# EAGLE design 2d_input (EAGLE 9.2.2)
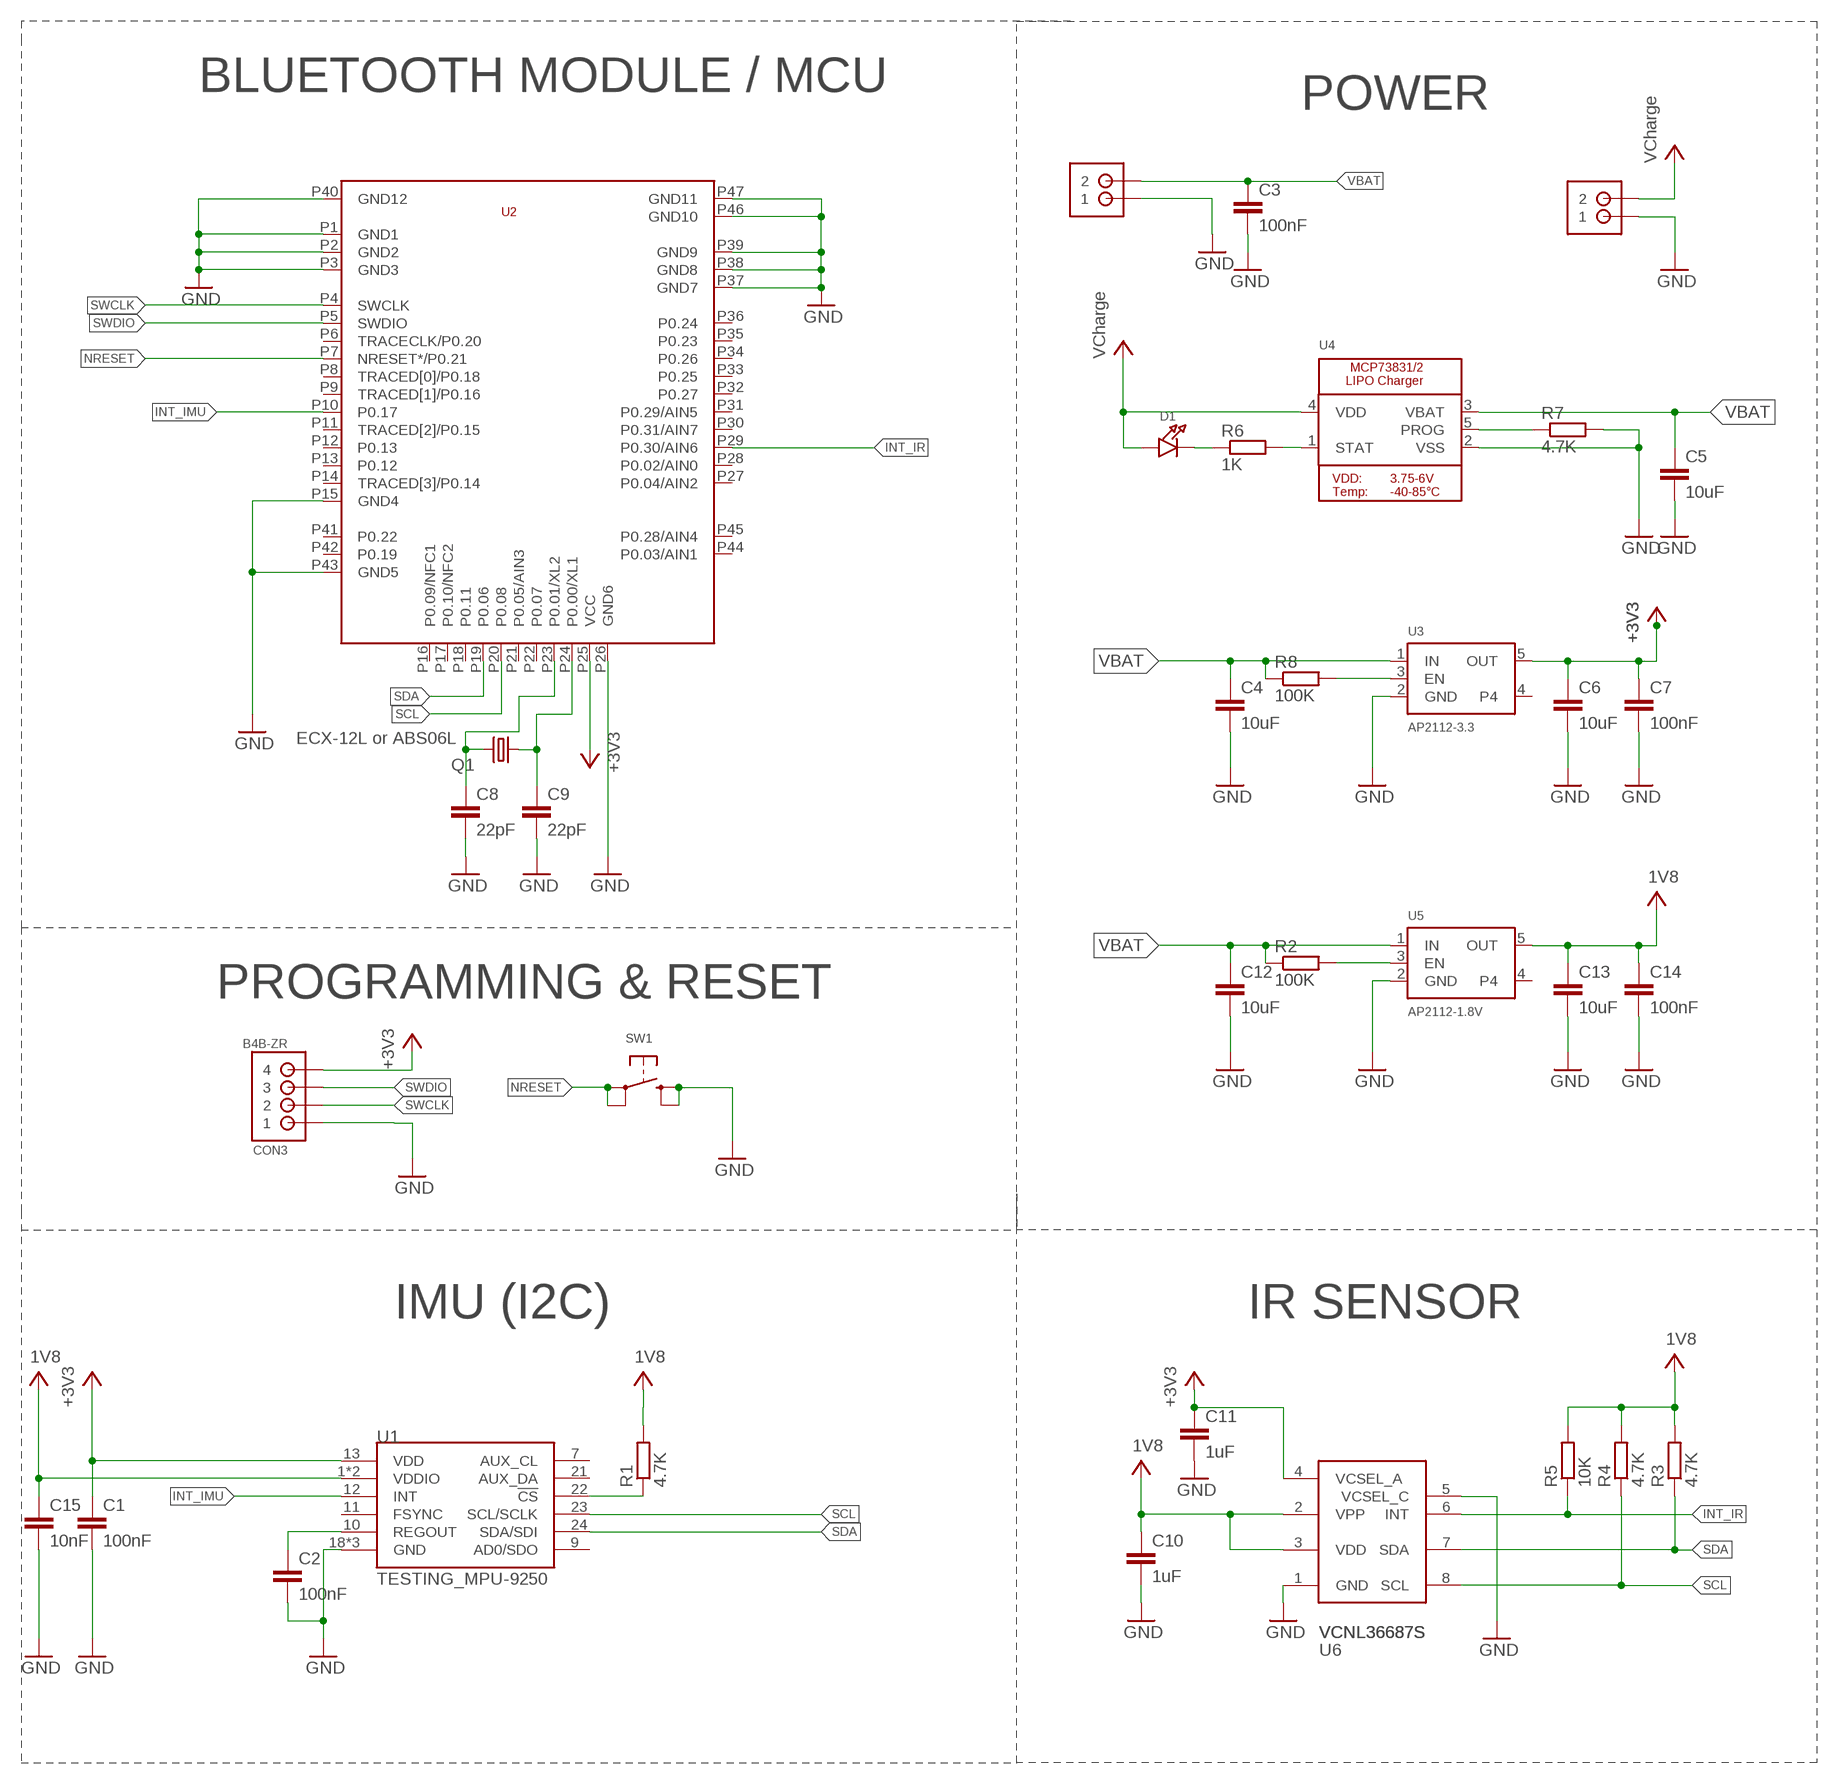
[diagram p0: schematic, sheet 1]

## Parts
C1  100nF  C-EUC0402K  [C0402K]
C2  100nF  C-EUC0402K  [C0402K]
C3  100nF  C-EUC0402K  [C0402K]
C4  10uF  C-EUC0402K  [C0402K]
C5  10uF  C-EUC0402K  [C0402K]
C6  10uF  C-EUC0402K  [C0402K]
C7  100nF  C-EUC0402K  [C0402K]
C8  22pF  C-EUC0402K  [C0402K]
C9  22pF  C-EUC0402K  [C0402K]
C10  1uF  C-EUC0402K  [C0402K]
C11  1uF  C-EUC0402K  [C0402K]
C12  10uF  C-EUC0402K  [C0402K]
C13  10uF  C-EUC0402K  [C0402K]
C14  100nF  C-EUC0402K  [C0402K]
C15  10nF  C-EUC0402K  [C0402K]
CON1  B2B-ZR  [B2B-ZR]
CON2  B2B-ZR  [B2B-ZR]
CON3  B4B-ZR  [B4B-ZR]
D1  MICROBUILDER_LED0603_NOOUTLINE  [MICROBUILDER_CHIPLED_0603_NOOUTLINE]
Q1  ECX-12L or ABS06L  KX-327-RT  [2.0X1.2]
R1  4.7K  R-EU_R0402  [R0402]
R2  100K  R-EU_R0402  [R0402]
R3  4.7K  R-EU_R0402  [R0402]
R4  4.7K  R-EU_R0402  [R0402]
R5  10K  R-EU_R0402  [R0402]
R6  1K  R-EU_R0402  [R0402]
R7  4.7K  R-EU_R0402  [R0402]
R8  100K  R-EU_R0402  [R0402]
SW1  MICROBUILDER_SWITCH_TACT_SMT4.6X2.8  [MICROBUILDER_BTN_KMR2_4.6X2.8]
U1  TESTING_MPU-9250  [TESTING_QFN24_PAD]
U2  BMD-350  [BMD-350]
U3  AP2112-3.3  MICROBUILDER_VREG_SOT23-5  [MICROBUILDER_SOT23-5]
U4  MICROBUILDER_MCP73831/2  [MICROBUILDER_SOT23-5]
U5  AP2112-1.8V  MICROBUILDER_VREG_SOT23-5  [MICROBUILDER_SOT23-5]
U6  VCNL36687S  [VCNL36687S]

## Nets
+3V3: C1.1 C6.1 C7.1 C11.1 CON3.4 U1.13(VDD) U2.P25(VCC) U3.5(OUT) U6.4(VCSEL_A)
GND: C1.2 C2.2 C3.2 C4.2 C5.2 C6.2 C7.2 C8.2 C9.2 C10.2 C11.2 C12.2 C13.2 C14.2 C15.2 CON1.1 CON2.1 CON3.1 R7.2 SW1.B'(S1) SW1.B(S) U1.18(GND) U1.20(GND) U1.CENTER(GND) U2.P1(GND1) U2.P2(GND2) U2.P3(GND3) U2.P15(GND4) U2.P26(GND6) U2.P37(GND7) U2.P38(GND8) U2.P39(GND9) U2.P40(GND12) U2.P43(GND5) U2.P46(GND10) U2.P47(GND11) U3.2(GND) U4.2(VSS) U5.2(GND) U6.1(GND) U6.5(VCSEL_C)
INT_IMU: U1.12(INT) U2.P10(P0.17)
INT_IR: R5.1 U2.P29(P0.30/AIN6) U6.6(INT)
N$1: C2.1 U1.10(REGOUT)
N$2: R7.1 U4.5(PROG)
N$3: C9.1 Q1.1 U2.P24(P0.00/XL1)
N$4: R1.1 U1.22(!CS)
N$5: R6.2 U4.1(STAT)
N$6: D1.C R6.1
N$8: R8.2 U3.3(EN)
N$9: R2.2 U5.3(EN)
N$10: C8.1 Q1.2 U2.P23(P0.01/XL2)
NRESET: SW1.A'(P1) SW1.A(P) U2.P7(NRESET*/P0.21)
SCL: R4.1 U1.23(SCL/SCLK) U2.P20(P0.08) U6.8(SCL)
SDA: R3.1 U1.24(SDA/SDI) U2.P19(P0.06) U6.7(SDA)
SWCLK: CON3.2 U2.P4(SWCLK)
SWDIO: CON3.3 U2.P5(SWDIO)
V+: C10.1 C13.1 C14.1 C15.1 R1.2 R3.2 R4.2 R5.2 U1.1(VDDIO) U1.8(VDDIO) U5.5(OUT) U6.2(VPP) U6.3(VDD) ; supply symbol labelled 1V8
VBAT: C3.1 C4.1 C5.1 C12.1 CON1.2 R2.1 R8.1 U3.1(IN) U4.3(VBAT) U5.1(IN)
VCC: CON2.2 D1.A U4.4(VDD) ; supply symbol labelled VCharge
Unconnected: U1.7(AUX_CL) U1.9(AD0/SDO) U1.11(FSYNC) U1.21(AUX_DA) U2.P6(TRACECLK/P0.20) U2.P8(TRACED[0]/P0.18) U2.P9(TRACED[1]/P0.16) U2.P11(TRACED[2]/P0.15) U2.P12(P0.13) U2.P13(P0.12) U2.P14(TRACED[3]/P0.14) U2.P16(P0.09/NFC1) U2.P17(P0.10/NFC2) U2.P18(P0.11) U2.P21(P0.05/AIN3) U2.P22(P0.07) U2.P27(P0.04/AIN2) U2.P28(P0.02/AIN0) U2.P30(P0.31/AIN7) U2.P31(P0.29/AIN5) U2.P32(P0.27) U2.P33(P0.25) U2.P34(P0.26) U2.P35(P0.23) U2.P36(P0.24) U2.P41(P0.22) U2.P42(P0.19) U2.P44(P0.03/AIN1) U2.P45(P0.28/AIN4) U3.4 U5.4

## Notes on the sheet
- BLUETOOTH MODULE / MCU
- POWER
- PROGRAMMING & RESET
- IMU (I2C) | IR SENSOR
- VCNL36687S | VCNL36687S | VCNL36687S
- U6

## Library data of the parts
C1-C15 = rcl:C-EU: CAPACITOR, European symbol; SPICEPREFIX: C
CON1 CON2 = con-jst-zh:B2B-ZR: JST-ZH Connector 2 pol, 1.5mm pitch Package: B2B-ZR Source: http://www.jst-mfg.com/product/pdf/eng/eZH.pdf
CON3 = con-jst-zh:B4B-ZR: JST-ZH Connector 4 pol, 1.5mm pitch Package: B4B-ZR Source: http://www.jst-mfg.com/product/pdf/eng/eZH.pdf
D1 = Minniemouse_v2:MICROBUILDER_LED: LED 0603 - 0603 Surface Mount Package 2mA: Green LED - Low Power (3.9mcd, 2ma, 1.7Vf) - Digikey: 475-2709-2-ND Orange LED - Low Power (9.8mcd, 2ma, 1.8Vf) - Digikey: 475-1194-2-ND Red LED - Low Power (5mcd, 2ma, 1.8Vf) - Digikey: 475-1195-2-ND Yellow LED - Low Power (7mcd, 2ma, 1.8Vf) - Digikey: 475-1196-2-ND 5mA: Blue LED - Low Power (17mcd, 5ma, 2.9Vf) - Digikey: LNJ937W8CRACT-ND 0805 - 0805 Surface Mount Package 2mA: Red LED (8.8mcd, 2mA, 1.8Vf, Clear) - Low Power [Digikey: 475-2510-1-ND] Green LED (5mcd, 2mA, 1.8Vf, Clear) - Low Power [Digikey: 475-2730-1-ND] Yellow LED (11.3mcd, 2mA, 1.8Vf, Clear) - Low Power [Digikey: 475-2555-1-ND] 20mA: Red LED (104mcd, 20mA, Diffused) - LS R976 [Digikey: 475-1278-6-ND] Red LED (12mcd, 20mA, 2.0Vf, Clear) - APT2012EC [Digikey: 754-1128-1-ND] Green LED (15mcd, 20mA, 2.2Vf, Clear) - APT2012GC [Digikey: 754-1131-1-ND] Orange LED (160mcd, 20mA, 2.1Vf, Clear) - APT2012SECK [Digikey: 754-1130-1-ND] 1206 - 1206 Surface Mount Package Green LED (26mcd, 20mA, Diffused) - LG N971 [Digikey: 475-1407-6-ND] Red LED (15mcd, 20mA, Diffused) - LH N974 [Digikey: 475-1416-6-ND] Cree - Cree High-Power Surface Mount LEDs XPEBWT-L1-0000-00D50 - White 111lm 350mA 2.9Vf 6200K 110° XTEAWT-00-0000-00000LEE3 - White 114lm 350mA 2.85Vf 5000K 115° Everlight - Everlight 45-21 Series Surface Mount LEDs 45-21/QK2C-B2832AC2CB2/2T - Warm White 2000mcd 20mA 3.25Vf 3050K 120° 45-21/LK2C-B38452C4CB2/2T - Nuetral White 2000mcd 20mA 3.25Vf 4150K 120° 45-21/LK2C-B50634C6CB2/2T - Cold White 2200mcd 20mA 3.25Vf 5650K 120° PLCC2 Reverse Mount LS T77K-J1L2-1-0-2-R18-Z - Red 11.25mcd 2mA 1.8Vf 630nm 120° LO T77K-L1M2-24-Z - Orange 19.6mcd 2mA 1.8Vf 606nm 120° LY T77K-K2M1-26-Z - Yellow 15.7mcd 2mA 1.8Vf 587nm 120°
Q1 = crystal-geyer_V1_0:KX-327: Tuning Fork Crystals (kHz) SMD: KX327 - Serie Model Size l/w/h [mm] Frequency Range Frequency Stability Temp. Range [°C] Load Capacitance AECQ 200 availabel Datasheet KX-327VT KX-327FT KX-327RT KX-327NHT KX-327NHF KX-327L KX-327S 1.25/1.05/0.5 1.6/1.0/0.5 2.0/1.2/0.6 3.2/1.5/0.8 3.2/1.5/0.8 7.0/1.5/1.4 8.2/3.8/2.5 32,768 kHz 32,768 kHz 32,768 kHz 32,768 kHz 32,768 kHz 32,768 kHz 32,768 kHz ±10 … ±20ppm ±10 … ±20ppm ±10 … ±20ppm ±10 … ±20ppm ±10 … ±20ppm ±10 … ±20ppm ±5 … ±20ppm (*) -40°C …+85°C (*) -40°C …+85°C (*) -40°C …+85°C (*) -40°C …+85°C (*) -40°C …+125°C (*) -40°C …+85°C (*) -40°C …+85°C 7/9/12,5 7/9/12,5 7/9/12,6 7/9/12,5 9/12,5 7/9/12,5 6/12,5 - - - - yes - - KX-327VT.pdf <http://www.geyer-electronic.de/uploads/tx_userartikelfrequenz/GEYER-KX-327VT.pdf> KX-327FT.pdf <http://www.geyer-electronic.de/uploads/tx_userartikelfrequenz/GEYER-KX-327FT.pdf> KX-327RT.pdf <http://www.geyer-electronic.de/uploads/tx_userartikelfrequenz/GEYER-KX-327RT.pdf> KX-327NHT.pdf <http://www.geyer-electronic.de/uploads/tx_userartikelfrequenz/GEYER-KX-327NHT.pdf> KX-327NHF.pdf <http://www.geyer-electronic.de/uploads/tx_userartikelfrequenz/GEYER-KX-327NHF.pdf> KX-327L.pdf <http://www.geyer-electronic.de/uploads/tx_userartikelfrequenz/GEYER-KX-327L.pdf> KX-327S.pdf <http://www.geyer-electronic.de/uploads/tx_userartikelfrequenz/GEYER-KX-327S.pdf> <http://www.geyer-electronic.de/fileadmin/template/img/logo-geyer-electronic.png> Details see: http://www.geyer-electronic.de/Frequenz-Produkte.9.0.html Created 2016-06-07, Hans Locher 2016 (C) Geyer Quartz Technology KX327VT,KX327FT,KX327RT,KX327NHT,KX327NHF,KX327S,KX327L;125105;1610;2012;3215;7015;8238;1,25x1,05,1.25x1.05;1,6x1,0,1.6x1.0;2,0x1,2,2.0x1.2;3,2x1,5,3.2x1.5;8,2x3,8,8.2x3.8,7.0x1.5,7,0x1,532.768kHz
R1-R8 = rcl:R-EU_: RESISTOR, European symbol; SPICEPREFIX: R
SW1 = Minniemouse_v2:MICROBUILDER_SWITCH_TACT_SMT: SMT Tact Switches 6x6mm - Digikey: P12940SCT-ND KMR2 (4.6x2.8mm) - Digikey: 401-1426-1-ND EVQ-PQHB55 - Light Touch, 160GF (4.5x4.5mm) - Digikey: P8090SCT-ND KMT0 - KMT021 NGJ LHS (etc.) IP68/Waterproof - Digikey: CKN10289CT-ND
U1 = SparkFun_MPU-9250_Breakout:TESTING_MPU-9250: NC pin 19. 2-6 & 14-17 not internally connected. May be used for PCB trace routing.; PROD_ID: IC-13192
U2 = BMD-350-Eagle:BMD-350
U3 U5 = Minniemouse_v2:MICROBUILDER_VREG_SOT23-5: SOT23-5 Fixed Voltage Regulators Part Current Out V Out V In V Dropout θJA (°C/W) TJ (°C) Digikey Part No. ADP121 150mA 3.3V 3.4-5.5V 0.09V @ 150mA -- -- ADP121-AUJZ33R7CT-ND ADP121 150mA 3.0V 3.1-5.5V 0.09V @ 150mA -- -- ADP121-AUJZ30R7CT-ND ADP122 300mA 3.3V 3.4-5.5V 0.085V @ 300mA -- -- ADP122AUJZ-3.3-R7CT-ND ADP1712 300mA 3.3V 3.5-5.5V 0.17V @ 300mA -- -- ADP1712AUJZ-3.3-R7TR-ND AP7311 (Low Cost) 150mA 3.3V 3.5-6V 0.15V @ 150mA -- -- AP7311-33WG-7DICT-ND LD39015M18R 150mA 1.8V 1.9V-5.5V 0.08V @ 100mA -- -- 497-6977-1-ND LP2985A-33DBVR 150mA 3.3V 3.3-16V 0.28V @ 150mA 206 150 296-18479-1-ND MCP1824T-3302E/OT 300mA 3.3V 3.5V-6V 0.2V @ 300mA -- -- MCP1824T-3302E/OTCT-ND MIC5205-2.5YM5 TR 150mA 2.5V 2.7-16V 0.165V @ 150mA -- -- 576-1257-2-ND MIC5205-3.0YM5 TR 150mA 3.0V 3.2V-16V 0.165V @ 150mA -- -- 576-1258-2-ND MIC5205-3.3YM5 TR 150mA 3.3V 3.5V-16V 0.165V @ 150mA -- -- 576-1259-2-ND TPS780330220 150mA 3.3V+2.2V 3.6-5.5V 250mV Max -- -- 296-23332-1-ND TDA3663/N1,135 100mA 3.3V 3.5-45V 0.18V @ 50mA -- -- 568-5343-1-ND Max operating temp can be calculated using θJA, TJ (max junction temperature), and power in watts. Set the "Maximum Ambient Temperature" until it reaches TJ ("Max Junction Temperature"), which is the absolute limit for safe use of the regulator: Heat Sink Temperature Calculator <http://www.daycounter.com/Calculators/Heat-Sink-Temperature-Calculator.phtml> For example, With 12V source into a 3.3V LP2985 and a 30mA load, we are dissipating (12V-3.3V) * 0.03A = 0.261W. With a θJA of 206 °C/W, a TJ of 150°C, and 261mW we can safely use the chip without a heat sink up to 75°C (=147.1°C Junction Temperature).
U4 = Minniemouse_v2:MICROBUILDER_MCP73831/2: MCP73831/2 LIPO Charger VDD: 3.75 - 6V Temp -40 - 85°C Programmable Charge Rate: 15-500mA NOTE: STAT is a tri-state logic output on the MCP73831 and an open-drain output on the MCP73832. SOT23-5 with 4.2V output and tri-state logic on STAT = MCP73831T-2ACI/OT
U6 = untitled:VCNL36687S

## Board
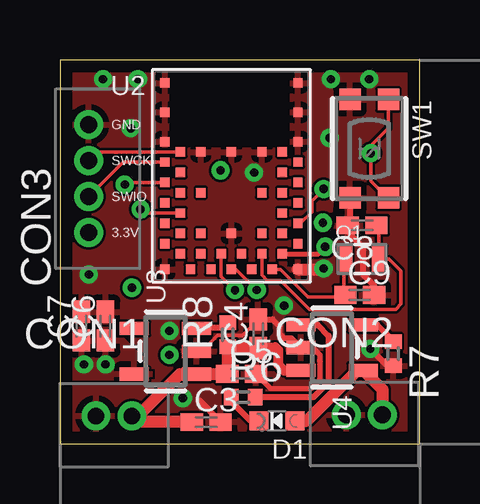
[diagram p1: board, top side]
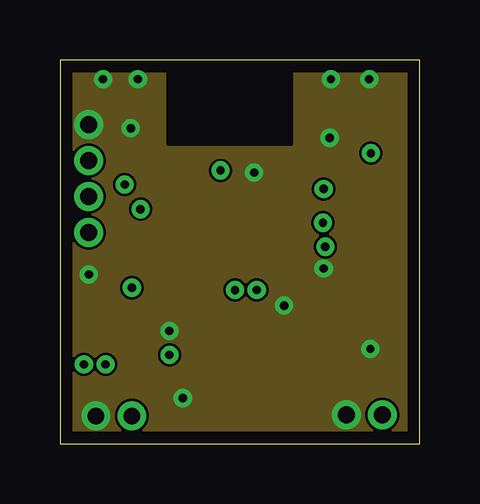
[diagram p2: board, inner layer GND_plane]
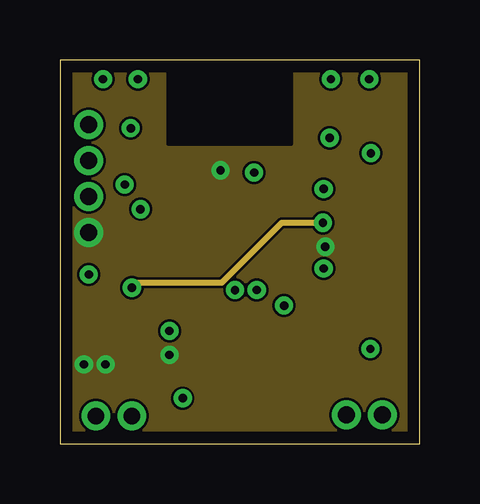
[diagram p3: board, inner layer Power_plane]
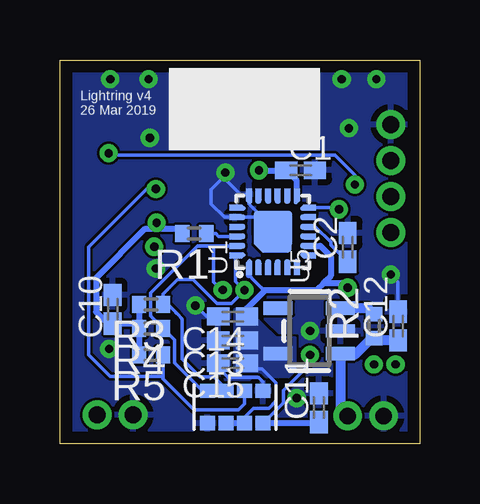
[diagram p4: board, bottom side, seen from below]

Size 15 x 16 mm. Coordinates in mm from the lower left corner, seen from the top.
Outline: 0,0 15,0 15,16 0,16 0,0
Copper layers (1+2*15+16): Top 0.035mm / dielectric 1.5mm / GND_plane 0.035mm / dielectric 0.15mm / Power_plane 0.035mm / dielectric 0.2mm / Bottom 0.035mm
Design rules "default *": minimum track width 6mil, minimum drill 0.35mm, track to track 4mil, track to pad 4mil, pad to pad 6mil, via to via 6mil, smd to smd 6mil, copper to edge 20mil, drill to drill 6mil, minimum pad ring 10mil, minimum via ring 8mil, stop-mask expansion 4mil, vias tented up to drill 0.4mm, thermal gap 10mil

### Footprints (pad centres in the part's own frame; a part is rotated, then mirrored left to right if it is on the bottom)
C0402K = smd 0.925 x 0.74: 1 -0.6,0; 2 0.6,0
B2B-ZR = drill 0.7 pad 1.1: 1 -0.75,-1.3; 2 0.75,-1.3
B4B-ZR = drill 0.7: 1 6,-1.3; 2 4.5,-1.3; 3 3,-1.3; 4 1.5,-1.3
MICROBUILDER_CHIPLED_0603_NOOUTLINE = smd 0.8 x 0.8: A 0,-0.75; C 0,0.75
2.0X1.2 = smd 0.6 x 1.1: 1 -0.7,0; 2 0.7,0
R0402 = smd 0.6 x 0.7: 1 -0.5,0; 2 0.5,0
MICROBUILDER_BTN_KMR2_4.6X2.8 = smd 0.9 x 0.9: A 2.05,0.8; A' -2.05,0.8; B 2.05,-0.8; B' -2.05,-0.8
TESTING_QFN24_PAD = smd 0.5 x 0.25: 1 -1.55,1; 2 -1.55,0.6; 3 -1.55,0.2; 4 -1.55,-0.2; 5 -1.55,-0.6; 6 -1.55,-1; 13 1.55,-1; 14 1.55,-0.6; 15 1.55,-0.2; 16 1.55,0.2; 17 1.55,0.6; 18 1.55,1 | smd 0.08 x 0.13: 1$1 -1.32,1.06; 1$3 -1.26,0.94; P$33 1.26,-0.94; P$34 1.32,-1.06; P$58 1.26,0.94; P$59 1.32,1.06; P$68 -1.26,-0.94; P$69 -1.32,-1.06 | smd 0.1 x 0.185 rotated 45: 1$2 -1.25,1.024; P$49 1.024,-1.25 | smd 0.14 x 0.14: 1$4 -1.22,0.945; P$23 -0.945,-1.22; P$24 1.22,-0.945; P$36 0.945,1.22; P$51 0.945,-1.22; P$56 1.22,0.945; P$61 -0.945,1.22; P$66 -1.22,-0.945 | smd 0.05 x 0.05: 1$5 -1.175,0.97; P$25 -0.97,-1.175; P$31 1.175,-0.97; P$37 0.97,1.175; P$52 0.97,-1.175; P$57 1.175,0.97; P$62 -0.97,1.175; P$67 -1.175,-0.97 | smd 0.25 x 0.5: 7 -1,-1.55; 8 -0.6,-1.55; 9 -0.2,-1.55; 10 0.2,-1.55; 11 0.6,-1.55; 12 1,-1.55; 19 1,1.55; 20 0.6,1.55; 21 0.2,1.55; 22 -0.2,1.55; 23 -0.6,1.55; 24 -1,1.55 | smd 0.25 x 0.25: CENTER 0,0 | smd 0.4 x 0.4: DBBADFE -0.675,0.24 | smd 0.6 x 1.2: DBBADFE1 -0.575,-0.195 | smd 0.25 x 0.3: P$1 -0.2,1.3; P$3 0.2,1.3; P$5 0.6,1.3; P$11 -0.6,1.3; P$16 0.2,-1.3; P$18 -0.2,-1.3; P$20 -0.6,-1.3; P$26 0.6,-1.3 | smd 0.3 x 0.25: P$2 -1.3,0.2; P$4 -1.3,0.6; P$28 -1.3,-0.2; P$38 -1.3,-0.6; P$40 1.3,0.2; P$42 1.3,-0.2; P$44 1.3,-0.6; P$50 1.3,0.6 | smd 0.1 x 0.185 rotated 225: P$7 1.25,-1.024; P$60 -1.024,1.25 | smd 1.1 x 1.59: P$13 0.325,0 | smd 0.3 x 0.5 rotated 315: P$14 -0.592,0.512 | smd 0.5 x 1.59: P$15 -0.27,0 | smd 0.1 x 0.185 rotated 135: P$22 -1.024,-1.25; P$55 1.25,1.024 | smd 0.13 x 0.08: P$27 -0.94,-1.26; P$29 -1.06,-1.32; P$39 0.94,1.26; P$41 1.06,1.32; P$53 0.94,-1.26; P$54 1.06,-1.32; P$63 -0.94,1.26; P$64 -1.06,1.32 | smd 0.1 x 0.185 rotated 315: P$35 1.024,1.25; P$65 -1.25,-1.024
BMD-350 = smd 0.39 x 0.39: P1 0.425,8.2; P2 0.425,6.975; P3 0.425,5.75; P4 1.075,5.325; P5 0.425,4.9; P6 1.075,4.475; P7 0.425,4.05; P8 1.075,3.625; P9 0.425,3.2; P10 1.075,2.775; P11 0.425,2.35; P12 1.075,1.925; P13 0.425,1.5; P14 1.075,1.075; P15 0.425,0.425; P16 1.5,0.425; P17 1.925,1.075; P18 2.35,0.425; P19 2.775,1.075; P20 3.2,0.425; P21 3.625,1.075; P22 4.05,0.425; P23 4.475,1.075; P24 4.9,0.425; P25 5.325,1.075; P26 5.975,0.425; P27 5.975,1.5; P28 5.325,1.925; P29 5.975,2.35; P30 5.325,2.775; P31 5.975,3.2; P32 5.325,3.625; P33 5.975,4.05; P34 5.325,4.475; P35 5.975,4.9; P36 5.325,5.325; P37 5.975,5.75; P38 5.975,6.975; P39 5.975,8.2; P40 1.925,5.325; P41 1.925,3.625; P42 1.925,1.925; P43 3.2,1.925; P44 4.475,1.925; P45 4.475,3.625; P46 4.475,5.325; P47 3.2,5.325
MICROBUILDER_SOT23-5 = smd 0.55 x 1.2: 1 -0.95,-1.3; 2 0,-1.3; 3 0.95,-1.3; 4 0.95,1.3; 5 -0.95,1.3
VCNL36687S = smd 0.6 x 0.625: 1 0,0; 2 0,-0.775; 3 0,-1.55; 4 0,-2.325; 5 1.35,-2.325; 6 1.35,-1.55; 7 1.35,-0.775; 8 1.35,0

### Placement (x,y rotation side)
C1  4.96,11.4 0 bottom
C2  3,8.18 90 bottom
C3  6.1,0.9 0 top
C4  8.27,4.58 90 top
C5  7.58,2.91 0 top
C6  1.9,4.9 90 top
C7  0.9,4.9 90 top
C8  12.6,9.1 180 top
C9  12.5,6.2 0 top
C10  12.8,5.6 90 bottom
C11  4.2,1.5 90 bottom
C12  0.9,4.9 90 bottom
C13  7.8,4.3 180 bottom
C14  7.8,5.3 180 bottom
C15  7.8,3.35 180 bottom
CON1  2.25,2.45 0 top
CON2  12.7,2.5 0 top
CON3  -0.1,7.3 90 top
D1  9.05,0.95 90 top
Q1  12.6,7.7 0 top
R1  9.4,8.76 180 bottom
R2  1.9,4.9 90 bottom
R3  11.2,5.8 180 bottom
R4  11.2,4.8 180 bottom
R5  11.2,3.7 180 bottom
R6  7.65,1.94 0 top
R7  13.9,3.75 270 top
R8  7,4.54 90 top
SW1  12.9,12.3 270 top
U1  6.12,8.84 90 bottom
U2  3.95,6.84 0 top
U3  4.4,3.85 90 top
U4  11.35,4 270 top
U5  4.6,4.7 90 bottom
U6  8.85,0.85 90 bottom

### Tracks (layer width: path | path; a pad name or v marks a point on that pad's centre or on a via)
+3V3  (via drill 0.35)
  Top 0.203: U2.P25 10.78,7.92 v11.07,8.21
  Bottom 0.152: U6.4 5.68,1.7 5.68,2.23 4.6,3.3 4.6,3.7 v4.57,3.7
  Bottom 0.254: U1.13 5.12,10.96 C1.1 v6.7,11.39 | C11.1 4.25,0.85 U6.4
  other vias: 1,3.3 1.9,3.3
  pour Power_plane (no thermals): 0,16 15,16 15,-0.1 0,-0.1
  pour Top: 0.5,4.8 2.2,4.8 3.8,3.2 3.8,2.7 0.5,2.7
GND  (via drill 0.35)
  Top 0.152: U3.2 5.9,3.85 6.57,4.52 7.61,4.52 C4.2 8.4,5.18
  Top 0.2: C5.2 8.79,2.3 10.48,2.3 10.85,2.67 10.85,3.41 10.85,3.7 10.55,4 U4.2
  Top 0.254: SW1.B 12.1,9.2 C8.2 12,8.85 12.64,8.2 12.64,7.06 13.1,6.6 C9.2 | U4.2 9.65,4.4 9.33,4.4 9.17,4.56 9.17,4.88 8.87,5.18 8.4,5.18 | 5.83,1.79 6.24,1.39 6.24,1.36 C3.2 | v12.95,3.95 13.65,3.25 R7.2
  Top 0.508: U2.P26 10.96,7.26 v11,7.3
  Bottom 0.152: v8.1,11.3 8.1,11.02 7.47,10.39 U1.18 7.12,9.99 6.21,9.09 6.21,8.94 | 8.1,11.2 8.7,10.6 8.7,10 8.14,9.44 U1.20 6.72,9.44 6.21,8.94 | 8.1,11.2 v8.1,11.3 | U1.CENTER 6.21,8.94 | 8.1,11.2 v8.1,11.3 | U6.5 6.53,2.57 6.71,2.75 8,2.75 8.4,3.15 C15.2 | C14.2 8.89,5.3 v9.35,5.76 | C12.2 0.9,6.75 v1.2,7.05
  other vias: 5.12,1.89 3.25,15.2 1.8,15.2 11.3,15.2 12.9,15.2 4.57,4.7 2.95,13.15 11.25,12.75
  pour Top (rank 2): 0,16 15,16 15,0 0,0
  pour GND_plane (no thermals): -0.2,16 -0.2,0 15,0 15,16
  pour Bottom (rank 2): -0.2,16 -0.2,0 15,0 15,16
  cutout GND_plane: 4.5,15.7 9.65,15.7 9.65,12.5 4.5,12.5
INT_IMU  (via drill 0.35)
  Top 0.152: U2.P10 3.62,9.62 3.46,9.77 v3.36,9.77
  Bottom 0.152: U1.12 3.42,9.84 v3.36,9.77
INT_IR  (via drill 0.35)
  Top 0.152: v11,10.62 10.5,10.12 10.5,9.66 10.03,9.19 U2.P29
  Bottom 0.152: U6.6 7.3,1.65 7.55,1.4 9.4,1.4 10.7,2.7 10.7,2.8 | 10.7,2.8 R5.1 | 10.7,2.8 12.9,2.8 13.8,3.71 13.8,8.2 11.4,10.6 11.02,10.6 v11,10.62
N$1
  Bottom 0.152: 4.49,9.04 4.36,9.04 | C2.1 3.7,8.28 3.7,8.4 4.34,9.04 4.49,9.04 | U1.10 4.49,9.04
N$2
  Top 0.254: R7.1 13.9,4.3 13.22,4.97 12.68,4.97 U4.5
N$3
  Top 0.152: U2.P24 9.2,7.26 10.35,6.12 11.81,6.12 C9.1 11.85,6.25 11.85,7.65 Q1.1
N$4
  Bottom 0.152: R1.1 8.5,8.76 8.4,8.66 8.38,8.64 U1.22
N$5
  Top 0.254: R6.2 10.59,1.94 11.2,2.55 11.2,4.5 10.75,4.95 U4.1
N$6
  Top 0.254: R6.1 7.1,1.89 7.1,1.8 7.95,0.95 D1.C
N$8
  Top 0.254: R8.2 6.79,4.83 5.68,4.83 5.66,4.8 U3.3
N$9
  Bottom 0.406: U5.3 2.15,5.65 R2.2
N$10
  Top 0.152: U2.P23 8.43,7.03 8.64,6.81 9.2,6.81 10.41,5.6 14,5.6 14.22,5.82 14.22,7.2 13.72,7.7 Q1.2 13.3,9.1 C8.1
NRESET  (via drill 0.35)
  Top 0.152: U2.P7 2.79,10.89 v2.7,10.8 | SW1.A 13.67,10.25 12.97,10.95 v12.97,12.11 12.97,12.43 13.7,13.16 SW1.A'
  Bottom 0.152: v12.97,12.11 12.9,12.04 3.54,12.04 2.7,11.2 v2.7,10.8
SCL  (via drill 0.35)
  Top 0.152: v8.21,6.41 | v8.21,6.41 7.35,7.26 U2.P20
  Bottom 0.152: U6.8 9.05,2.2 10.22,3.37 10.22,4.32 R4.1 11.22,5.32 11.22,6.28 10.1,7.4 9.27,8.23 8.6,8.23 | 8.6,8.23 7.75,8.23 7.74,8.24 U1.23 | 8.6,8.23 8.6,6.75 8.26,6.41 v8.21,6.41
SDA  (via drill 0.35)
  Top 0.152: U2.P19 6.72,7.1 | 6.72,7.1 6.72,7 | v7.3,6.4 6.72,6.98 6.72,7.1
  Bottom 0.152: U6.7 8.07,2.29 8.56,2.78 9.15,2.78 9.9,3.52 9.9,5.2 10.1,5.4 | 10.1,5.4 10.5,5.8 R3.1 10.7,6.25 10.1,6.85 9.45,6.85 8.45,5.85 7.85,5.85 v7.3,6.4 | 10.1,5.4 10.15,5.45 | v7.3,6.4 v7.29,6.41 | U1.24 7.67,6.77 v7.3,6.4 | v7.3,6.4
SWCLK
  Top 0.152: U2.P4 1.56,12.16 CON3.2
SWDIO
  Top 0.152: U2.P5 2.64,11.74 CON3.3
V+  (via drill 0.35)
  Power_plane 0.254: v10.97,9.21 9.25,9.21 6.74,6.7 3.2,6.7 v3,6.5
  Bottom 0.152: 7.12,7.03 6.91,6.81 6.8,6.7 | 6.8,6.7 6.47,6.38 | U6.3 7.3,1.09 6.92,1.47 6.29,1.47 5.99,1.78 5.99,2.52 6.57,3.11 6.96,3.11 | 6.8,6.7 6.49,6.4
  Bottom 0.254: 9.97,8.76 R1.2 10.1,8.96 10.97,8.96 | 6.96,3.11 C15.1 | U6.3 U6.2 | R4.2 R5.2 | R4.2 11.9,5 12.7,5 | 12.7,5 C10.1 | R3.2 R4.2 | 10.97,8.96 11.2,8.96 11.44,8.96 13.5,6.9 13.5,5.5 13,5 12.7,5 | U1.8 4.14,8.24 3.7,7.8 3.7,7 3.9,6.8 4,6.7 | C14.1 7.2,5.64 6.47,6.38 | 6.49,6.4 4.3,6.4 4,6.7 | 4,6.7 3.2,6.7 v3,6.5 | v10.97,9.21 10.97,8.96 | U1.1 7.12,7.08 7.12,7.03
  cutout Power_plane: 4.5,15.7 9.65,15.7 9.65,12.5 4.5,12.5
  pour Bottom (no thermals): 5.3,4.4 6,4.4 6.6,5 6.8,5.2 6.8,5.6 7.7,5.6 7.7,2.8 5.3,2.8 5.2,2.9 5.2,4.4
VBAT
  Top 0.406: C4.1 8.31,4.02 8.98,4.02 9.09,3.91 9.09,3.58 9.1,3.57 9.1,3.3 9.35,3.05 U4.3
  Top 0.508: C4.1 8.21,4.04 R8.1 6.98,4.02 C5.1 6.74,2.91 6.72,2.9 U3.1 5,2.9 3.25,1.15 CON1.2 3.25,0.9 C3.1
  Bottom 0.406: C12.1 1.8,4.3 R2.1 2,4.4 2.7,3.7 3.25,3.7 U5.1 3.3,1.45 CON1.2
VCC
  Top 0.508: D1.A 10.3,0.95 12.4,3.05 U4.4 13.45,2.25 CON2.2

### Text on the board
tPlace: GND | SWCK | SWIO | 3.3V
bPlace: Lightring v4 / 26 Mar 2019